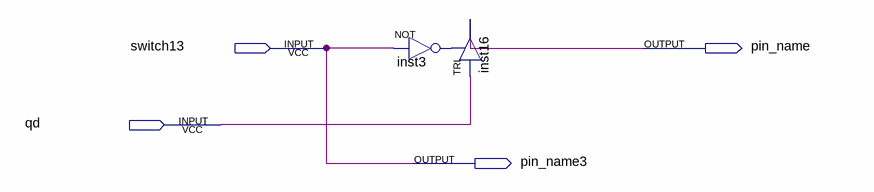
[diagram p0: schematic sheet]
// Quartus schematic change.bdf as structural Verilog: 2 symbols, 4 pins
module change (
  input  switch13,
  input  qd,
  output pin_name,
  output pin_name3
);

  wire inst3_out;

  TRI inst16 (.IN(qd), .OE(inst3_out), .OUT(pin_name));
  not inst3 (inst3_out, switch13);

  assign pin_name3 = switch13;
endmodule
